# Altium schematic sheet wifi-bt.SchDoc
size B
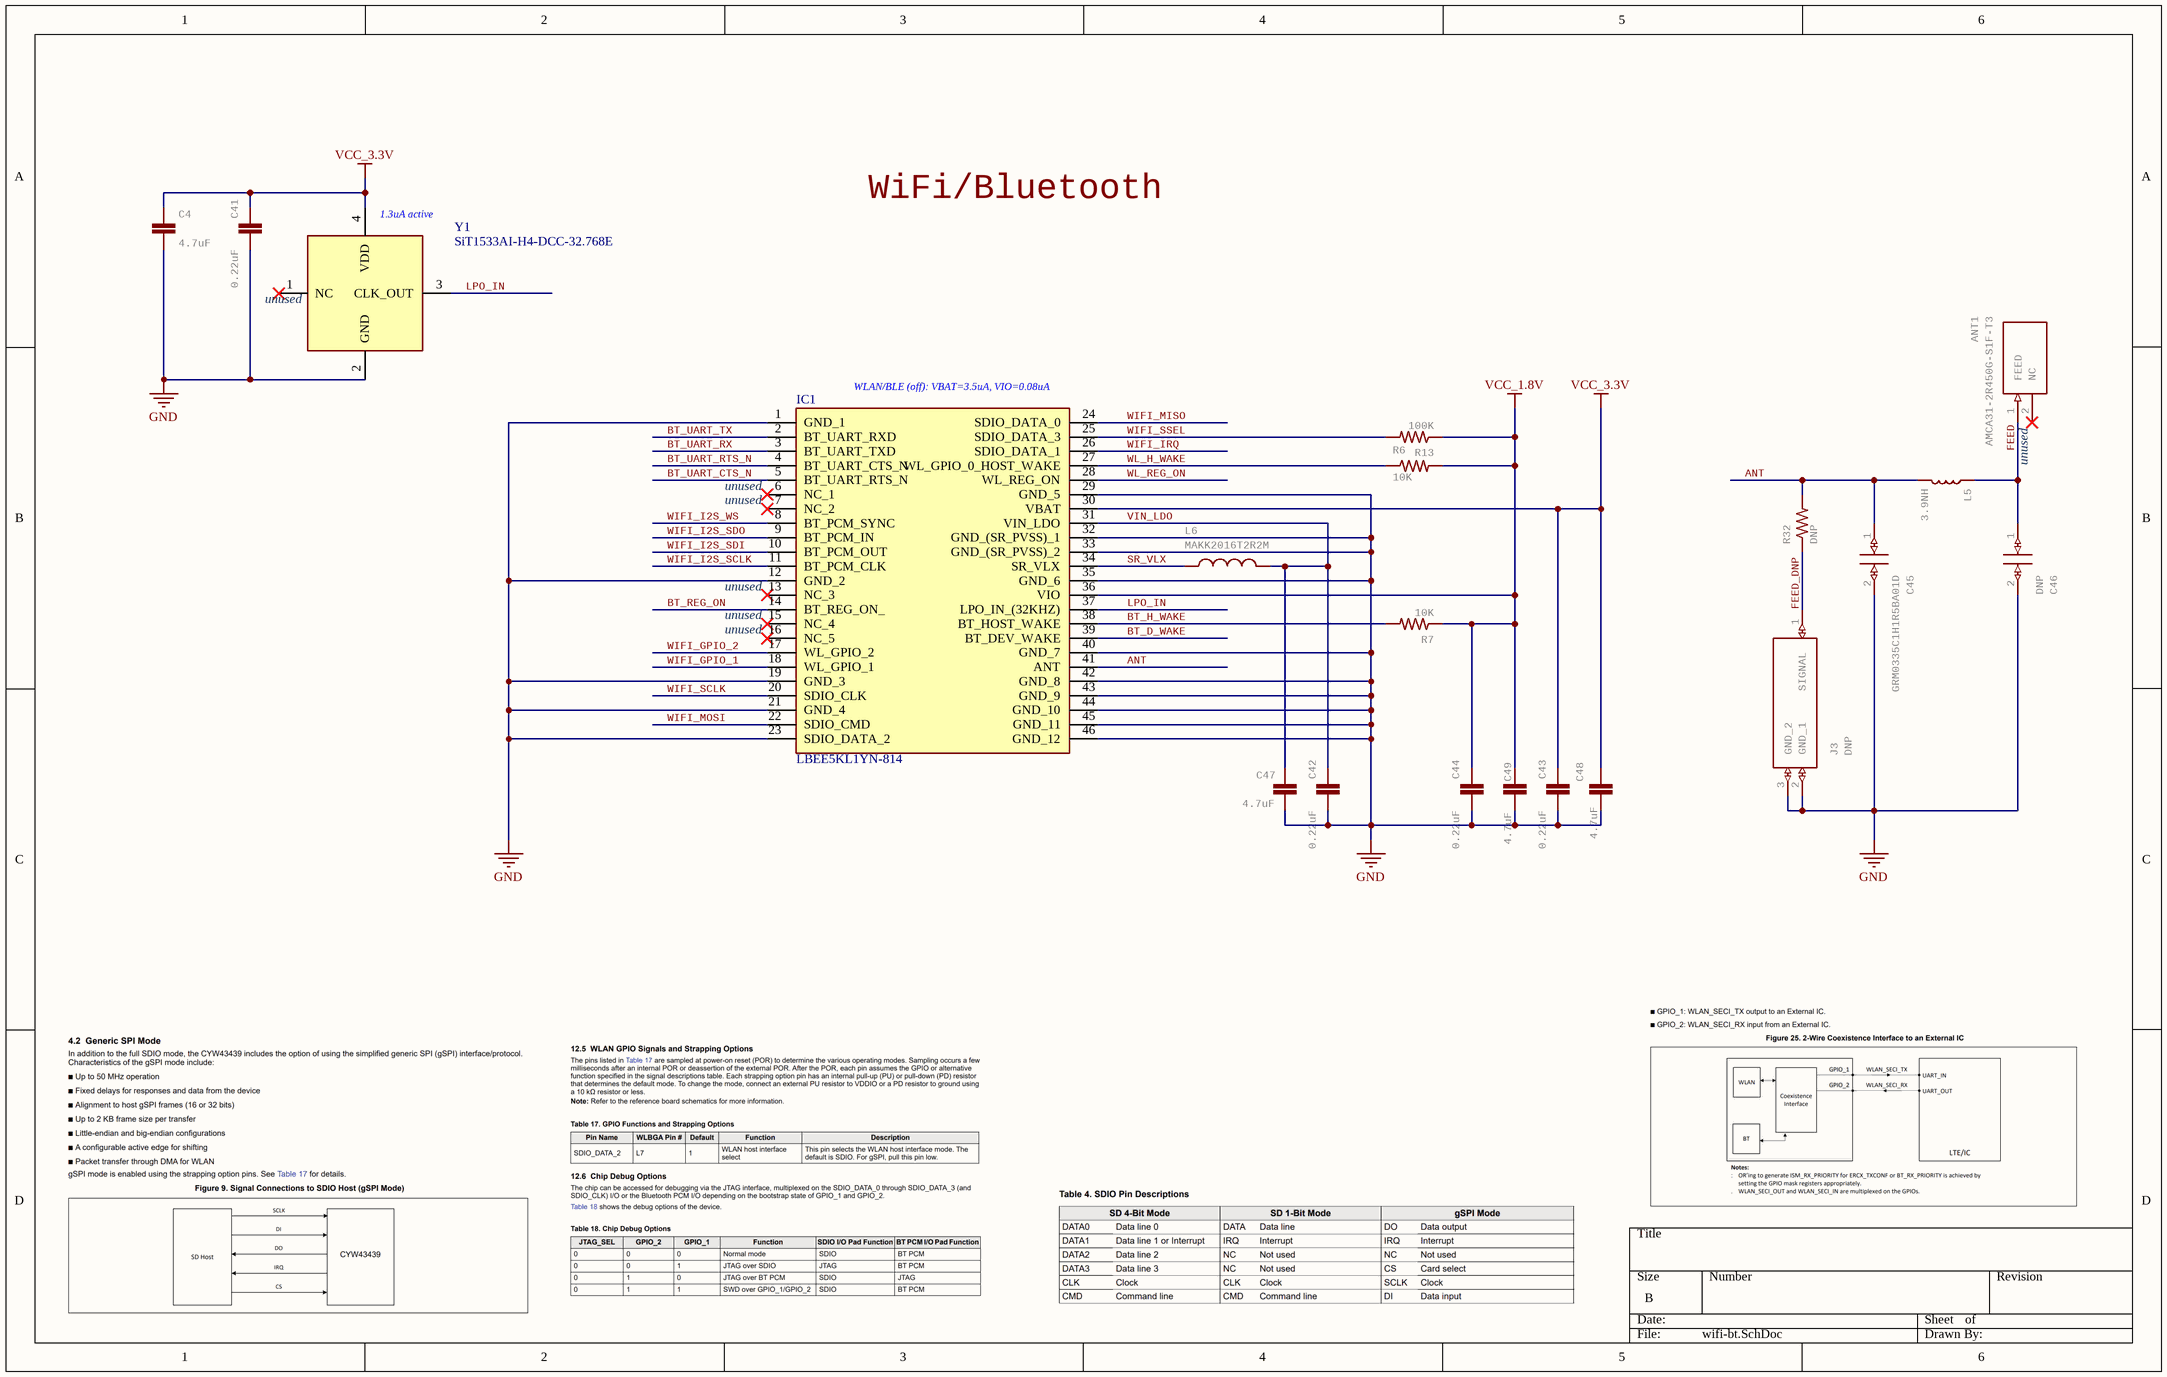
[diagram p0: wifi-bt.SchDoc]

## Parts
ANT1  AMCA31-2R450G-S1F-T3  [ANTC3216X140N]
C4  4.7uF  [0402-CAP]
C41  0.22uF  [C0201]
C42  0.22uF  [C0201]
C43  0.22uF  [C0201]
C44  0.22uF  [C0201]
C45  GRM0335C1H1R5BA01D  [CAPC0603X33N]
C46  DNP  [C0201-NO-3D]
C47  4.7uF  [0402-CAP]
C48  4.7uF  [0402-CAP]
C49  4.7uF  [0402-CAP]
IC1  LBEE5KL1YN-814  [LBEE5KL1YN814]
J3  DNP  [23370191-NO-3D]
L5  3.9NH  [0402]
L6  MAKK2016T2R2M  [INDC2016X100N]
R6  10K  [R0201]
R7  10K  [R0201]
R13  100K  [R0201]
R32  DNP  [R0201]
Y1  SiT1533AI-H4-DCC-32.768E  [SIT1533AIH4AA332768E]

## Nets
GND: C4.1 C41.2 C42.2 C43.2 C44.2 C45.2 C46.2 C47.1 C48.1 C49.1 IC1.1(GND_1) IC1.12(GND_2) IC1.19(GND_3) IC1.21(GND_4) IC1.23(SDIO_DATA_2) IC1.29(GND_5) IC1.32(GND_(SR_PVSS)_1) IC1.33(GND_(SR_PVSS)_2) IC1.35(GND_6) IC1.40(GND_7) IC1.42(GND_8) IC1.43(GND_9) IC1.44(GND_10) IC1.45(GND_11) IC1.46(GND_12) J3.2(GND_1) J3.3(GND_2) Y1.2(GND)
VCC_1.8V: C44.1 C49.2 IC1.36(VIO) R6.2 R7.1 R13.1
VCC_3.3V: C4.2 C41.1 C43.1 C48.2 IC1.30(VBAT) Y1.4(VDD)
ANT: C45.1 IC1.41(ANT) L5.2 R32.2
BT_D_WAKE: IC1.39(BT_DEV_WAKE)
BT_H_WAKE: IC1.38(BT_HOST_WAKE) R7.2
BT_REG_ON: IC1.14(BT_REG_ON_)
BT_UART_CTS_N: IC1.5(BT_UART_RTS_N)
BT_UART_RTS_N: IC1.4(BT_UART_CTS_N)
BT_UART_RX: IC1.3(BT_UART_TXD)
BT_UART_TX: IC1.2(BT_UART_RXD)
FEED: ANT1.1(FEED) C46.1 L5.1
FEED_DNP: J3.1(SIGNAL) R32.1
LPO_IN: IC1.37(LPO_IN_(32KHZ)) Y1.3(CLK_OUT)
SR_VLX: IC1.34(SR_VLX) L6.1
VIN_LDO: C42.1 C47.2 IC1.31(VIN_LDO) L6.2
WIFI_GPIO_1: IC1.18(WL_GPIO_1)
WIFI_GPIO_2: IC1.17(WL_GPIO_2)
WIFI_I2S_SCLK: IC1.11(BT_PCM_CLK)
WIFI_I2S_SDI: IC1.10(BT_PCM_OUT)
WIFI_I2S_SDO: IC1.9(BT_PCM_IN)
WIFI_I2S_WS: IC1.8(BT_PCM_SYNC)
WIFI_IRQ: IC1.26(SDIO_DATA_1)
WIFI_MISO: IC1.24(SDIO_DATA_0)
WIFI_MOSI: IC1.22(SDIO_CMD)
WIFI_SCLK: IC1.20(SDIO_CLK)
WIFI_SSEL: IC1.25(SDIO_DATA_3) R13.2
WL_H_WAKE: IC1.27(WL_GPIO_0_HOST_WAKE) R6.1
WL_REG_ON: IC1.28(WL_REG_ON)

Not connected (* = marked no-connect by the designer): ANT1 2(NC)*; IC1 6(NC_1)* 7(NC_2)* 13(NC_3)* 15(NC_4)* 16(NC_5)*; Y1 1(NC)*

## Notes on the sheet
- (near Y1) 1.3uA active
- WiFi/Bluetooth
- (near Y1) unused
- (near IC1) WLAN/BLE (off): VBAT=3.5uA, VIO=0.08uA
- (near ANT1) unused
- (near IC1) unused

## Library data of the parts
ANT1 = AMCA31-2R450G-S1F-T3: ABRACON - AMCA31-2R450G-S1F-T3 - ANTENNA, CHIP, 2.45GHZ, 50 OHM, 1206   Source:  Datasheet; GateName_1: G$1; SymbolName_1: AMCA31-2R450G-S1F-T3; LibraryName: AMCA31-2R450G-S1F-T3; DeviceSetName: AMCA31-2R450G-S1F-T3; HEIGHT: 1.4mm; MANUFACTURER_NAME: ABRACON; MANUFACTURER_PART_NUMBER: AMCA31-2R450G-S1F-T3; MOUSER_PART_NUMBER: 815-CA312R450GS1FT3; MOUSER_PRICE-STOCK: https://www.mouser.co.uk/ProductDetail/ABRACON/AMCA31-2R450G-S1F-T3?qs=AAveGqk956GLuOddQEK40Q%3D%3D; MPN: AMCA31-2R450G-S1F-T3; Part Number: AMCA31-2R450G-S1F-T3
C4 C47-C49 = CAP0402-CAP: CapacitorStandard 0603 ceramic capacitor, and 0.1" leaded capacitor.; MPN: JMK105BBJ475MV-F; GateName_1: G$1; SymbolName_1: CAP; DeviceName: 0402-CAP; LibraryName: sfe; DeviceSetName: CAP; Part Number: JMK105BBJ475MV-F
C41-C44 = C-EUC0201: CAPACITOR, European symbol; MPN: GRM033R60J224ME15D; GateName_1: G$1; SymbolName_1: C-EU; POPULARITY: 0; DeviceName: C0201; LibraryName: rcl; DeviceSetName: C-EU; SPICEPREFIX: C; Part Number: GRM033R60J224ME15D
C45 = GRM0335C1H1R5BA01D: Chip Capacitor value 1R5   Source:  Datasheet; MANUFACTURER_NAME: Murata Electronics; GateName_1: G$1; SymbolName_1: GRM0335C1H1R5BA01D; LibraryName: GRM0335C1H1R5BA01D; DeviceSetName: GRM0335C1H1R5BA01D; HEIGHT: 0.33mm; MANUFACTURER_PART_NUMBER: GRM0335C1H1R5BA01D; MOUSER_PART_NUMBER: 81-GRM0335C1H1R5BA1D; MOUSER_PRICE-STOCK: https://www.mouser.co.uk/ProductDetail/Murata-Electronics/GRM0335C1H1R5BA01D?qs=7vGxPDjevFPFqveGwv%252BPUQ%3D%3D; MPN: GRM0335C1H1R5BA01D; Part Number: GRM0335C1H1R5BA01D
C46 = GRM0335C1H1R5BA01D: Chip Capacitor value 1R5   Source:  Datasheet; MANUFACTURER_NAME: Murata Electronics; GateName_1: G$1; POPULATE: 0; SymbolName_1: GRM0335C1H1R5BA01D; LibraryName: GRM0335C1H1R5BA01D; DeviceSetName: GRM0335C1H1R5BA01D; HEIGHT: 0.33mm; MANUFACTURER_PART_NUMBER: GRM0335C1H1R5BA01D; MOUSER_PART_NUMBER: 81-GRM0335C1H1R5BA1D; MOUSER_PRICE-STOCK: https://www.mouser.co.uk/ProductDetail/Murata-Electronics/GRM0335C1H1R5BA01D?qs=7vGxPDjevFPFqveGwv%252BPUQ%3D%3D; MPN: DNP; Part Number: DNP
IC1 = LBEE5KL1YN-814: Integrated Circuit; Manufacturer_Name: Murata Electronics; Datasheet Link: https://www.murata.com/products/productdata/8815814344734/type1yn.pdf; Height: 1.1mm; Manufacturer_Part_Number: LBEE5KL1YN-814; Mouser Part Number: 81-LBEE5KL1YN-814; Mouser Price/Stock: https://www.mouser.co.uk/ProductDetail/Murata-Electronics/LBEE5KL1YN-814?qs=TCDPyi3sCW1FrH0sh%252Bb5wA%3D%3D; Arrow Part Number: LBEE5KL1YN-814; Arrow Price/Stock: https://www.arrow.com/en/products/lbee5kl1yn-814/murata-manufacturing?region=nac; Part Number: LBEE5KL1YN-814; MPN: LBEE5KL1YN-814
J3 = 2337019-1: RF Connectors / Coaxial Connectors MicroCoax receptacle UMCC Gen 1   Source:  Datasheet; MANUFACTURER_NAME: TE Connectivity; GateName_1: G$1; POPULATE: 0; SymbolName_1: 2337019-1; LibraryName: 2337019-1; DeviceSetName: 2337019-1; HEIGHT: 1.4mm; MANUFACTURER_PART_NUMBER: 2337019-1; MOUSER_PART_NUMBER: 571-2337019-1; MOUSER_PRICE-STOCK: https://www.mouser.co.uk/ProductDetail/TE-Connectivity/2337019-1?qs=l4Gc20tDgJIuN7nS9rJkJw%3D%3D; MPN: DNP; Part Number: DNP
L5 = INDUCTOR-0402-3.9NH: Inductors    Resist changes in electrical current. Basically a coil of wire.   SparkFun Products:  SparkFun Load Cell Amplifier - HX711  IOIO-OTG - V2.2; MPN: L-07C3N9SV6T; GateName_1: G$1; PROD_ID: NDUC-13457; SymbolName_1: INDUCTOR; DeviceName: -0402-3.9NH; LibraryName: SparkFun-Coils; DeviceSetName: INDUCTOR; Part Number: L-07C3N9SV6T
L6 = MAKK2016T2R2M: INDUCTOR, METAL CORE Check availability; GateName_1: G$1; MF: Taiyo Yuden; SymbolName_1: MAKK2016T2R2M; LibraryName: MAKK2016T2R2M; DeviceSetName: MAKK2016T2R2M; AVAILABILITY: In Stock; MP: MAKK2016T2R2M; MPN: MAKK2016T2R2M; PACKAGE: 2016 Taiyo Yuden; PRICE: None; PURCHASE-URL: https://pricing.snapeda.com/search/part/MAKK2016T2R2M/?ref=eda; Part Number: MAKK2016T2R2M
R6 R7 = RESISTOR0402-RES: MPN: RMCF0201FT10K0; GateName_1: G$1; SymbolName_1: RESISTOR; LibraryName: sfe; DeviceSetName: RESISTOR; Part Number: RMCF0201FT10K0
R13 = RESISTOR0402-RES: MPN: RMCF0201FT100K; GateName_1: G$1; SymbolName_1: RESISTOR; LibraryName: sfe; DeviceSetName: RESISTOR; Part Number: RMCF0201FT100K
R32 = RESISTOR0402-RES: GateName_1: G$1; SymbolName_1: RESISTOR; LibraryName: sfe; DeviceSetName: RESISTOR; MPN: DNP; Part Number: DNP
Y1 = SIT1533AI-H4-AA3-32.768E: Crystal or Oscillator; Manufacturer_Name: SiTime; Datasheet Link: https://www.mouser.com/datasheet/2/371/SiT1533_datasheet-1324419.pdf; Height: 0.6mm; Manufacturer_Part_Number: SiT1533AI-H4-DCC-32.768E; Mouser Part Number: 788-1533AIH4DCC32.76; Mouser Price/Stock: https://www.mouser.com/ProductDetail/SiTime/SiT1533AI-H4-DCC-32.768E?qs=5SDzjInHUKoUZz9ePr9JwA%3D%3D; Arrow Part Number: SiT1533AI-H4-DCC-32.768E; MPN: SiT1533AI-H4-DCC-32.768E; Part Number: SiT1533AI-H4-DCC-32.768E